# Altium schematic sheet Sheet1.SchDoc
size A0
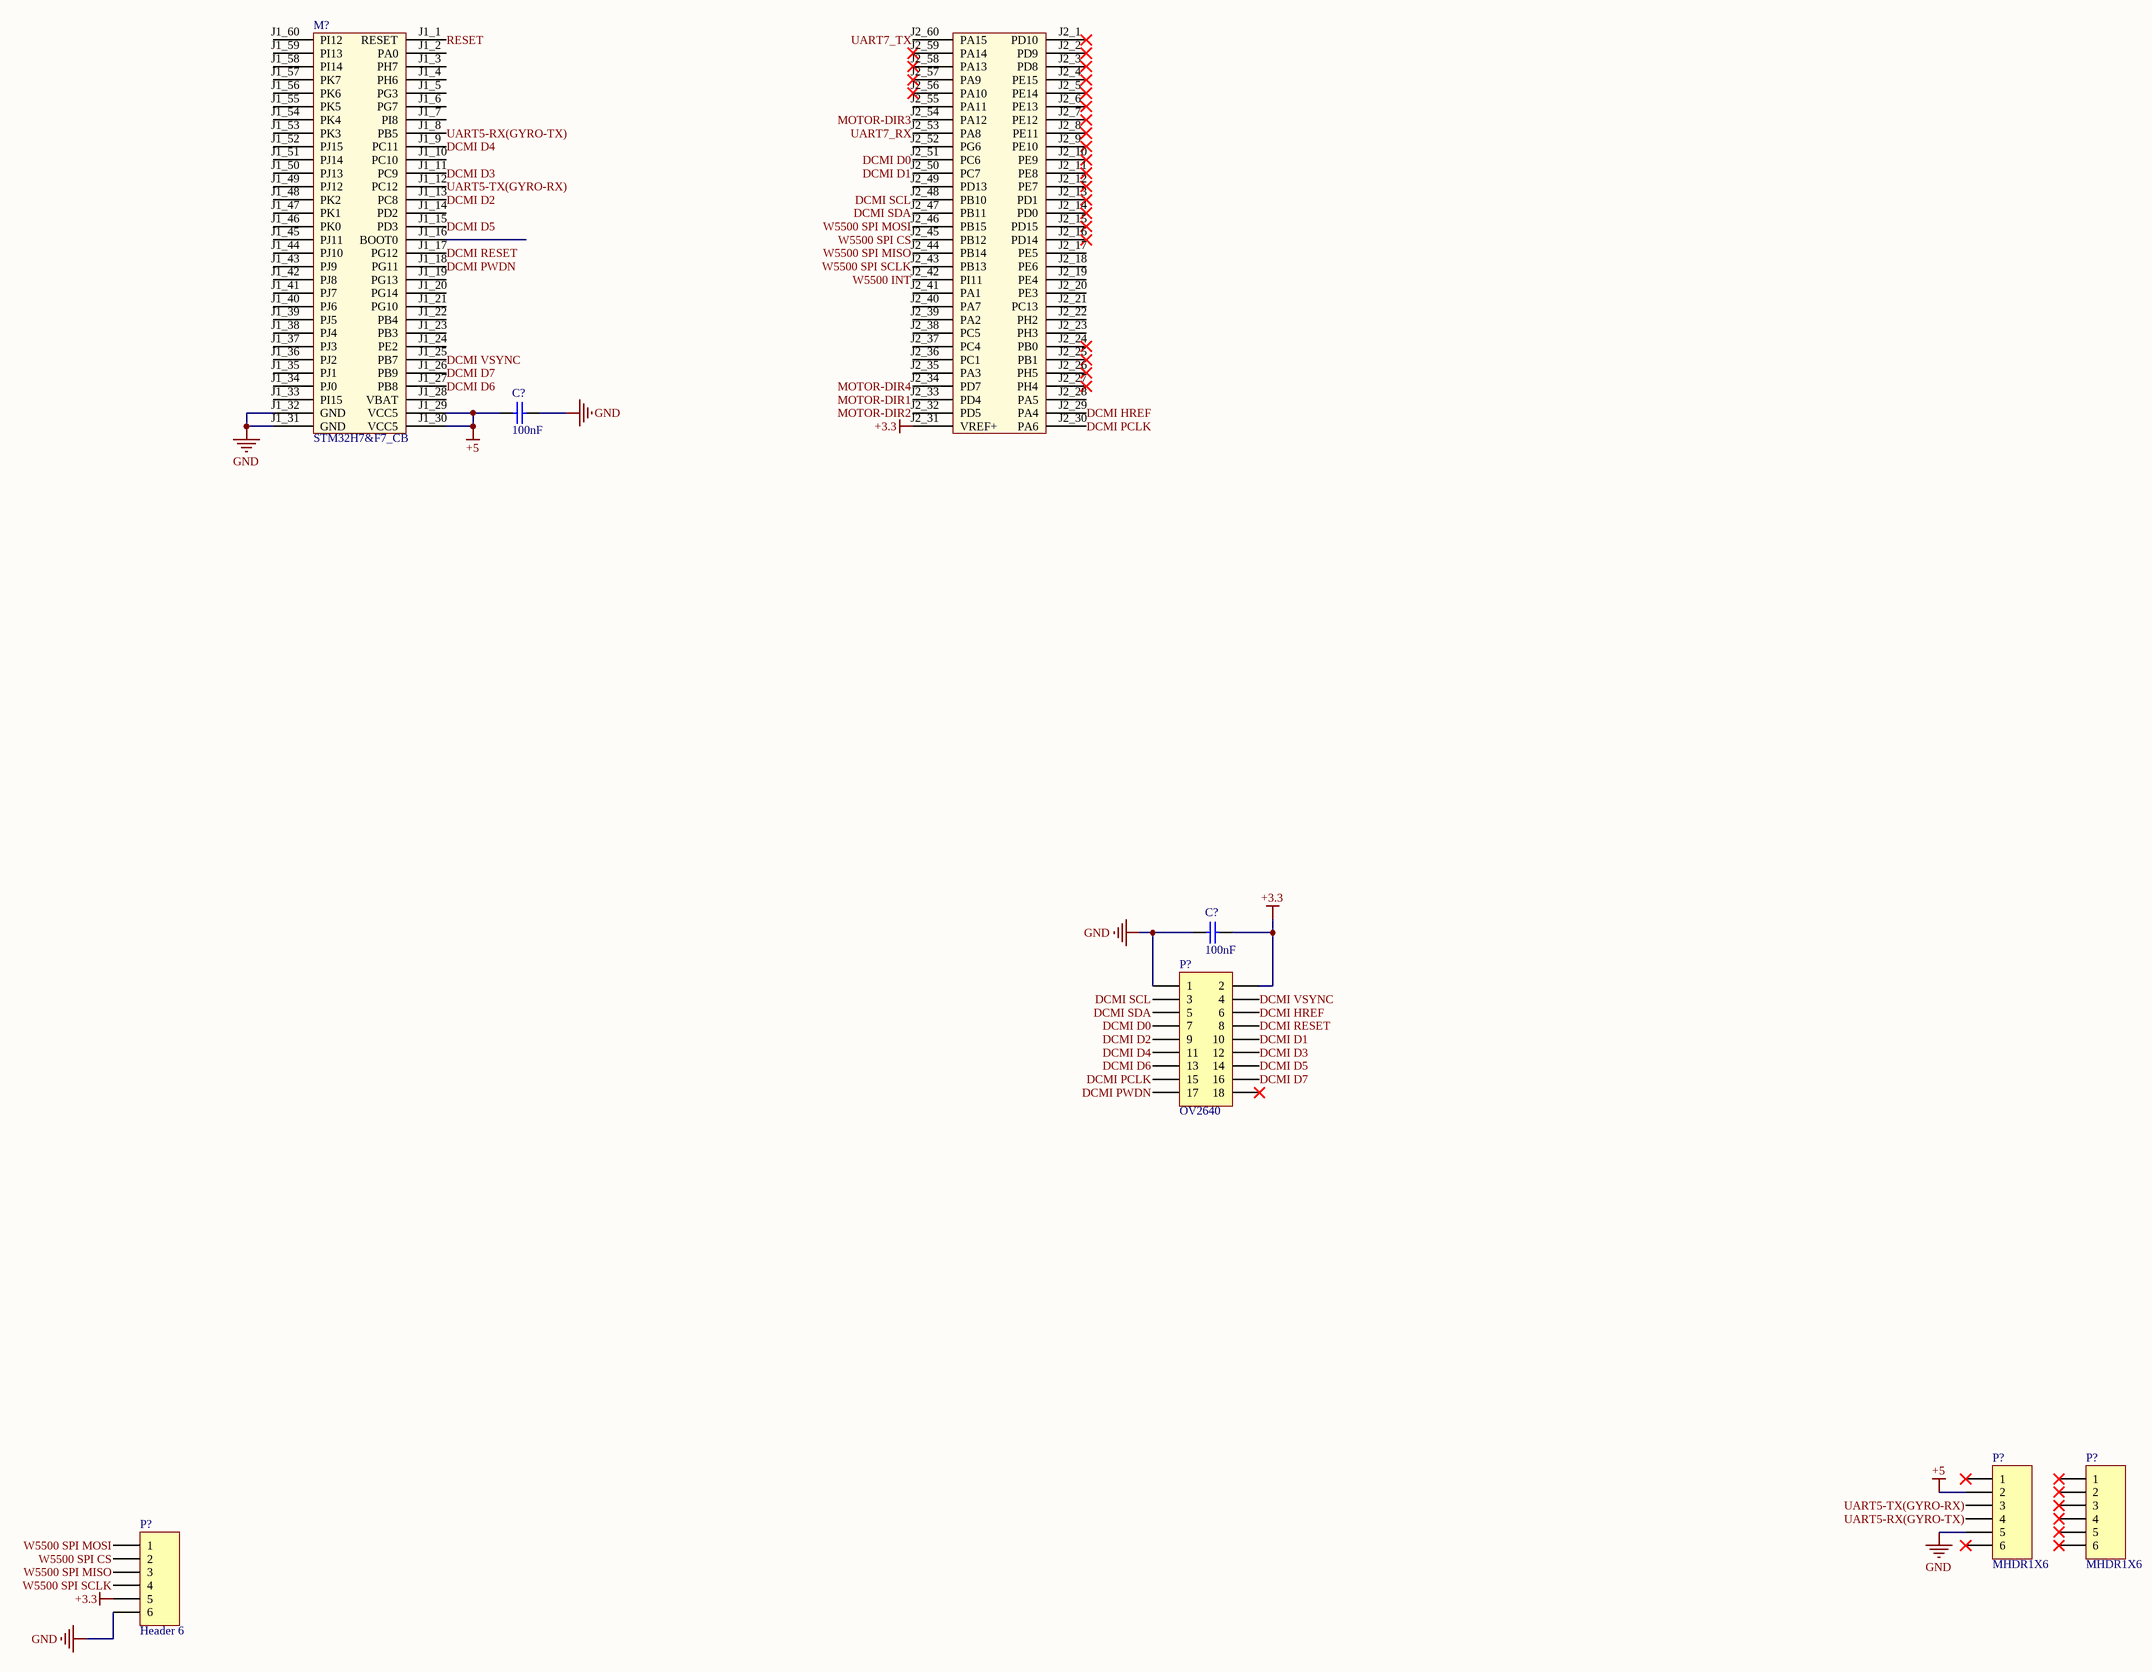
[diagram p0: Sheet1.SchDoc]

## Parts
(Parts that share a designator on the sheet are numbered #1, #2 ... from top to bottom, then left to right.)
C?#1  100nF  [CAPC2012X10M]
C?#2  100nF  [CAPC2012X10M]
M?  STM32H7&F7_CB  [STM32H7&F7_CB]
P?#1  OV2640  [HDR2X9]
P?#2  MHDR1X6  [MPIN-6-2.54-1.0]
P?#3  MHDR1X6  [MPIN-6-2.54-1.0]
P?#4  Header 6  [HDR1X6]

## Nets
+3.3: C?#2.2 M?.J2_31(VREF+) P?#1.2 P?#4.5
+5: C?#1.1 M?.J1_29(VCC5) M?.J1_30(VCC5) P?#2.2
GND: C?#1.2 C?#2.1 M?.J1_31(GND) M?.J1_32(GND) P?#1.1 P?#2.5 P?#4.6
DCMI D0: M?.J2_51(PC6) P?#1.7
DCMI D1: M?.J2_50(PC7) P?#1.10
DCMI D2: M?.J1_13(PC8) P?#1.9
DCMI D3: M?.J1_11(PC9) P?#1.12
DCMI D4: M?.J1_9(PC11) P?#1.11
DCMI D5: M?.J1_15(PD3) P?#1.14
DCMI D6: M?.J1_27(PB8) P?#1.13
DCMI D7: M?.J1_26(PB9) P?#1.16
DCMI HREF: M?.J2_29(PA4) P?#1.6
DCMI PCLK: M?.J2_30(PA6) P?#1.15
DCMI PWDN: M?.J1_18(PG11) P?#1.17
DCMI RESET: M?.J1_17(PG12) P?#1.8
DCMI SCL: M?.J2_48(PB10) P?#1.3
DCMI SDA: M?.J2_47(PB11) P?#1.5
DCMI VSYNC: M?.J1_25(PB7) P?#1.4
MOTOR-DIR1: M?.J2_33(PD4)
MOTOR-DIR2: M?.J2_32(PD5)
MOTOR-DIR3: M?.J2_54(PA12)
MOTOR-DIR4: M?.J2_34(PD7)
RESET: M?.J1_1(RESET)
UART5-RX(GYRO-TX): M?.J1_8(PB5) P?#2.4
UART5-TX(GYRO-RX): M?.J1_12(PC12) P?#2.3
UART7_RX: M?.J2_53(PA8)
UART7_TX: M?.J2_60(PA15)
W5500 INT: M?.J2_42(PI11)
W5500 SPI CS: M?.J2_45(PB12) P?#4.2
W5500 SPI MISO: M?.J2_44(PB14) P?#4.3
W5500 SPI MOSI: M?.J2_46(PB15) P?#4.1
W5500 SPI SCLK: M?.J2_43(PB13) P?#4.4

Not connected (* = marked no-connect by the designer): M? J1_2(PA0) J1_3(PH7) J1_4(PH6) J1_5(PG3) J1_6(PG7) J1_7(PI8) J1_10(PC10) J1_14(PD2) J1_16(BOOT0) J1_19(PG13) J1_20(PG14) J1_21(PG10) J1_22(PB4) J1_23(PB3) J1_24(PE2) J1_28(VBAT) J1_33(PI15) J1_34(PJ0) J1_35(PJ1) J1_36(PJ2) J1_37(PJ3) J1_38(PJ4) J1_39(PJ5) J1_40(PJ6) J1_41(PJ7) J1_42(PJ8) J1_43(PJ9) J1_44(PJ10) J1_45(PJ11) J1_46(PK0) J1_47(PK1) J1_48(PK2) J1_49(PJ12) J1_50(PJ13) J1_51(PJ14) J1_52(PJ15) J1_53(PK3) J1_54(PK4) J1_55(PK5) J1_56(PK6) J1_57(PK7) J1_58(PI14) J1_59(PI13) J1_60(PI12) J2_1(PD10)* J2_2(PD9)* J2_3(PD8)* J2_4(PE15)* J2_5(PE14)* J2_6(PE13)* J2_7(PE12)* J2_8(PE11)* J2_9(PE10)* J2_10(PE9)* J2_11(PE8)* J2_12(PE7)* J2_13(PD1)* J2_14(PD0)* J2_15(PD15)* J2_16(PD14)* J2_17(PE5) J2_18(PE6) J2_19(PE4) J2_20(PE3) J2_21(PC13) J2_22(PH2) J2_23(PH3) J2_24(PB0)* J2_25(PB1)* J2_26(PH5)* J2_27(PH4)* J2_28(PA5) J2_35(PA3) J2_36(PC1) J2_37(PC4) J2_38(PC5) J2_39(PA2) J2_40(PA7) J2_41(PA1) J2_49(PD13) J2_52(PG6) J2_55(PA11) J2_56(PA10)* J2_57(PA9)* J2_58(PA13)* J2_59(PA14)*; P?#1 18*; P?#2 1* 6*; P?#3 1* 2* 3* 4* 5* 6*

## Library data of the parts
C?#1 C?#2 = Cap: Capacitor; Published: 8-Jun-2000; LatestRevisionDate: 17-Jul-2002; LatestRevisionNote: Re-released for DXP Platform.; PackageReference: RAD-0.3; Publisher: Altium Limited; PackageDescription: Radial Cap, Thru-Hole; 2 Leads; 0.3 in Pin Spacing
M? = STM32H7&F7_CB: H750/F750 Core Board
P?#1 = Header 9X2: Header, 9-Pin, Dual row; LatestRevisionDate: 17-Jul-2002; LatestRevisionNote: Re-released for DXP Platform.; Publisher: Altium Limited
P?#2 P?#3 = MHDR1X6: Header, 6-Pin; LatestRevisionDate: 17-Jul-2002; LatestRevisionNote: Re-released for DXP Platform.; Publisher: Altium Limited
P?#4 = Header 6: Header, 6-Pin; LatestRevisionDate: 17-Jul-2002; LatestRevisionNote: Re-released for DXP Platform.; Publisher: Altium Limited